# EAGLE design nintendo-hid (EAGLE 7.4.0)

## Sheet 1 of 5: MCU
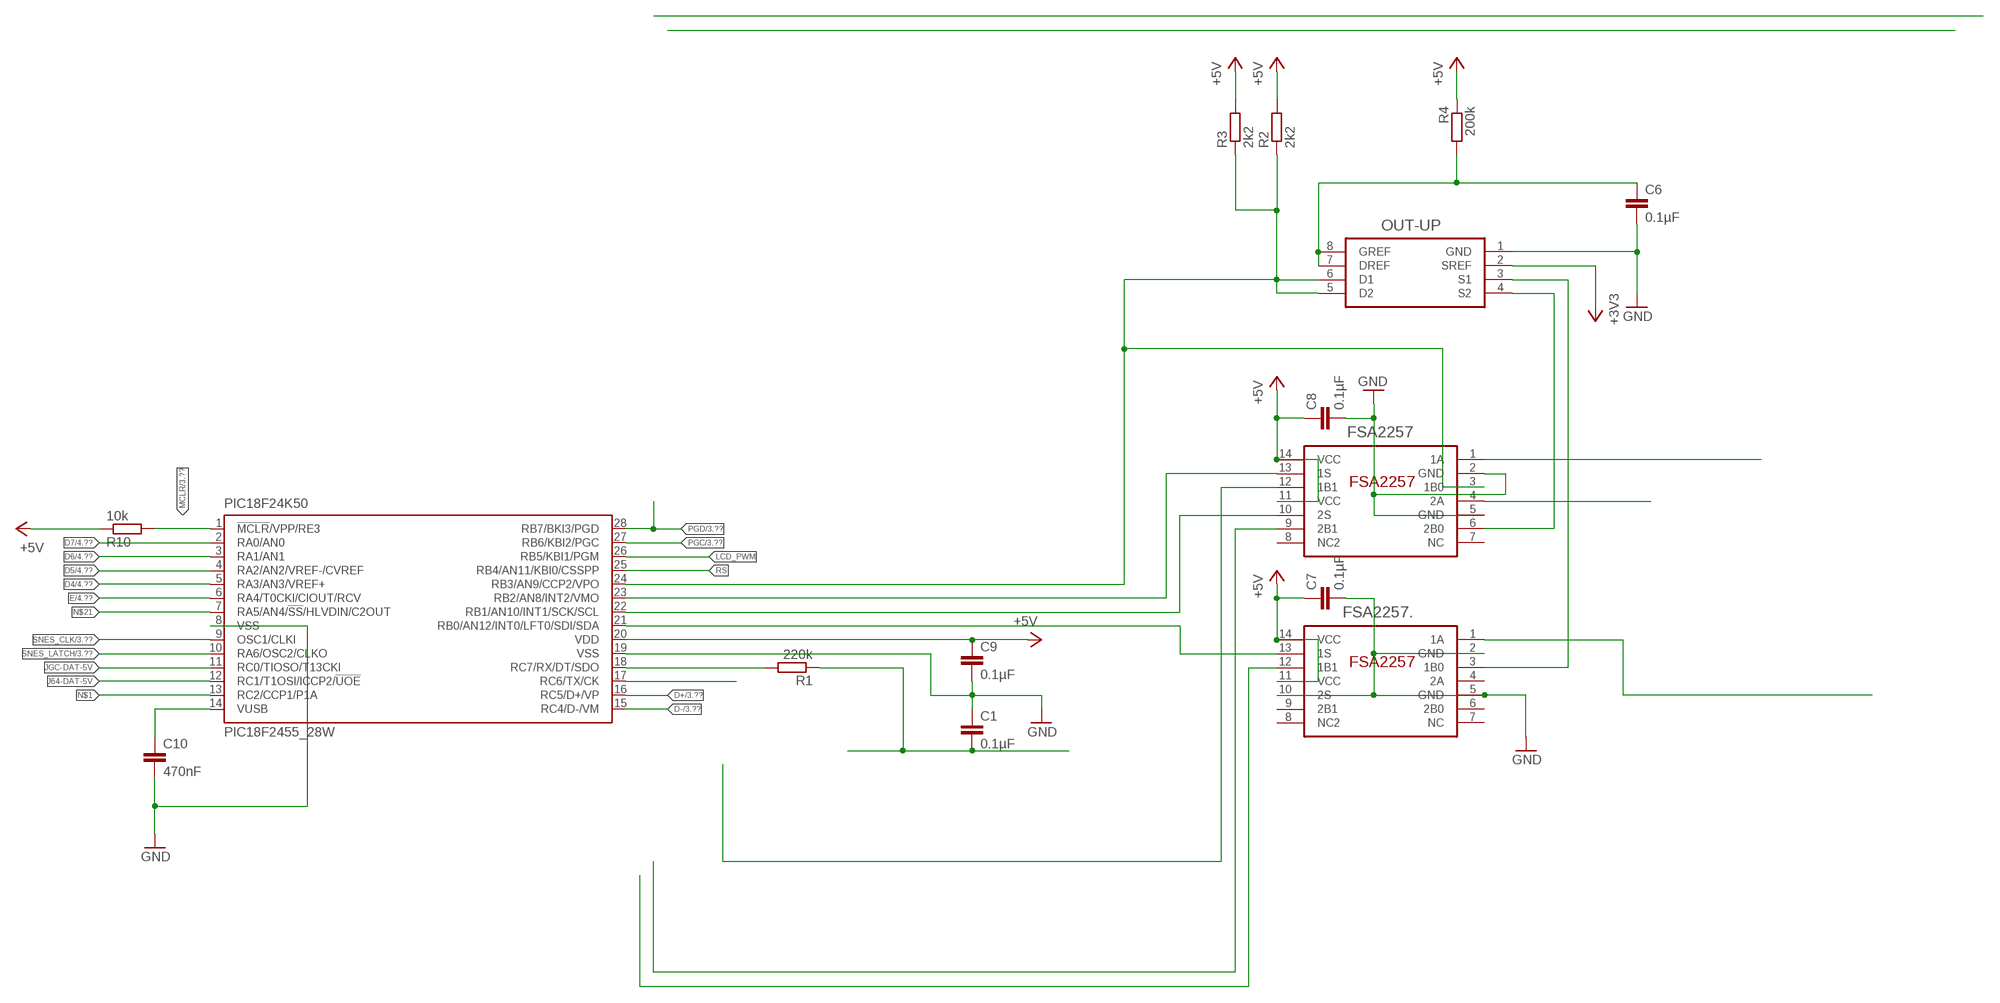
[diagram p0: schematic, sheet 1]

### Parts
C1  0.1µF  C-EUC0603  [C0603]
C6  0.1µF  C-EUC0603  [C0603]
C7  0.1µF  C-EUC0603  [C0603]
C8  0.1µF  C-EUC0603  [C0603]
C9  0.1µF  C-EUC0603K  [C0603K]
C10  470nF  C-EUC0603  [C0603]
FSA2257  FSA2257MTCX  [TSSOP14]
FSA2257.  FSA2257MTCX  [TSSOP14]
OUT-UP  GTL2002D  [SOIC127P600X175-8N]
PIC18F24K50  PIC18F2455_28W  [SO28W]
R1  220k  R-EU_R0603  [R0603]
R2  2k2  R-EU_R0603  [R0603]
R3  2k2  R-EU_R0603  [R0603]
R4  200k  R-EU_R0603  [R0603]
R10  10k  R-EU_R0603  [R0603]

### Nets
+3V3: OUT-UP.2(SREF) ; also sheet 3,5
+5V: C7.1 C8.1 C9.1 FSA2257.11(VCC) FSA2257.14(VCC) FSA2257..11(VCC) FSA2257..14(VCC) PIC18F24K50.20(VDD) R2.2 R3.2 R4.1 R10.1 ; also sheet 3,4,5
D4: PIC18F24K50.5(RA3/AN3/VREF+) ; also sheet 4
D5: PIC18F24K50.4(RA2/AN2/VREF-/CVREF) ; also sheet 4
D6: PIC18F24K50.3(RA1/AN1) ; also sheet 4
D7: PIC18F24K50.2(RA0/AN0) ; also sheet 4
D+: PIC18F24K50.16(RC5/D+/VP) ; also sheet 3
D-: PIC18F24K50.15(RC4/D-/VM) ; also sheet 3
E: PIC18F24K50.6(RA4/T0CKI/CIOUT/RCV) ; also sheet 4
FAKE_3V3.1: FSA2257.6(2B0) OUT-UP.4(S2)
FAKE_3V3.2: FSA2257..3(1B0) OUT-UP.3(S1)
FAKE_5V: FSA2257.3(1B0) OUT-UP.5(D2) OUT-UP.6(D1) PIC18F24K50.24(RB3/AN9/CCP2/VPO) R2.1 R3.1
GND: C1.1 C6.2 C7.2 C8.2 C9.2 C10.2 FSA2257.2(GND) FSA2257.5(GND) FSA2257..2(GND) FSA2257..5(GND) FSA2257..10(2S) OUT-UP.1(GND) PIC18F24K50.8(VSS) PIC18F24K50.19(VSS) ; also sheet 3,4,5
J64-DAT-5V: PIC18F24K50.12(RC1/T1OSI/ICCP2/!UOE)
J64_DAT: FSA2257.9(2B1) ; also sheet 3
JGC-DAT-5V: PIC18F24K50.11(RC0/TIOSO/T13CKI)
JGC_DAT: FSA2257..12(1B1) ; also sheet 3
JSNES_DAT: FSA2257.12(1B1)
LCD_PWM: PIC18F24K50.26(RB5/KBI1/PGM) ; also sheet 4
MCLR: PIC18F24K50.1(!MCLR!/VPP/RE3) R10.2 ; also sheet 3
N$1: PIC18F24K50.13(RC2/CCP1/P1A)
N$4: FSA2257.4(2A) ; also sheet 3
N$13: FSA2257..1(1A) ; also sheet 3
N$16: C10.1 PIC18F24K50.14(VUSB)
N$20: C6.1 OUT-UP.7(DREF) OUT-UP.8(GREF) R4.2
N$21: PIC18F24K50.7(RA5/AN4/!SS!/HLVDIN/C2OUT)
N$22: PIC18F24K50.17(RC6/TX/CK) ; also sheet 3
PGC: PIC18F24K50.27(RB6/KBI2/PGC) ; also sheet 3
PGD: PIC18F24K50.28(RB7/BKI3/PGD) ; also sheet 3
RS: PIC18F24K50.25(RB4/AN11/KBI0/CSSPP) ; also sheet 4
S1: FSA2257.13(1S) PIC18F24K50.23(RB2/AN8/INT2/VMO)
S2: FSA2257.10(2S) PIC18F24K50.22(RB1/AN10/INT1/SCK/SCL)
S3: FSA2257..13(1S) PIC18F24K50.21(RB0/AN12/INT0/LFT0/SDI/SDA)
SNES_CLK: PIC18F24K50.9(OSC1/CLKI) ; also sheet 3
SNES_LATCH: PIC18F24K50.10(RA6/OSC2/CLKO) ; also sheet 3
SNES_OUT: FSA2257.1(1A) ; also sheet 3
USB-SENSE: PIC18F24K50.18(RC7/RX/DT/SDO) R1.2
VBUS: C1.2 R1.1
Unconnected: FSA2257.7(NC) FSA2257.8(NC2) FSA2257..4(2A) FSA2257..6(2B0) FSA2257..7(NC) FSA2257..8(NC2) FSA2257..9(2B1)

## Sheet 2 of 5: SIGNALS

## Sheet 3 of 5: CONNECTORS
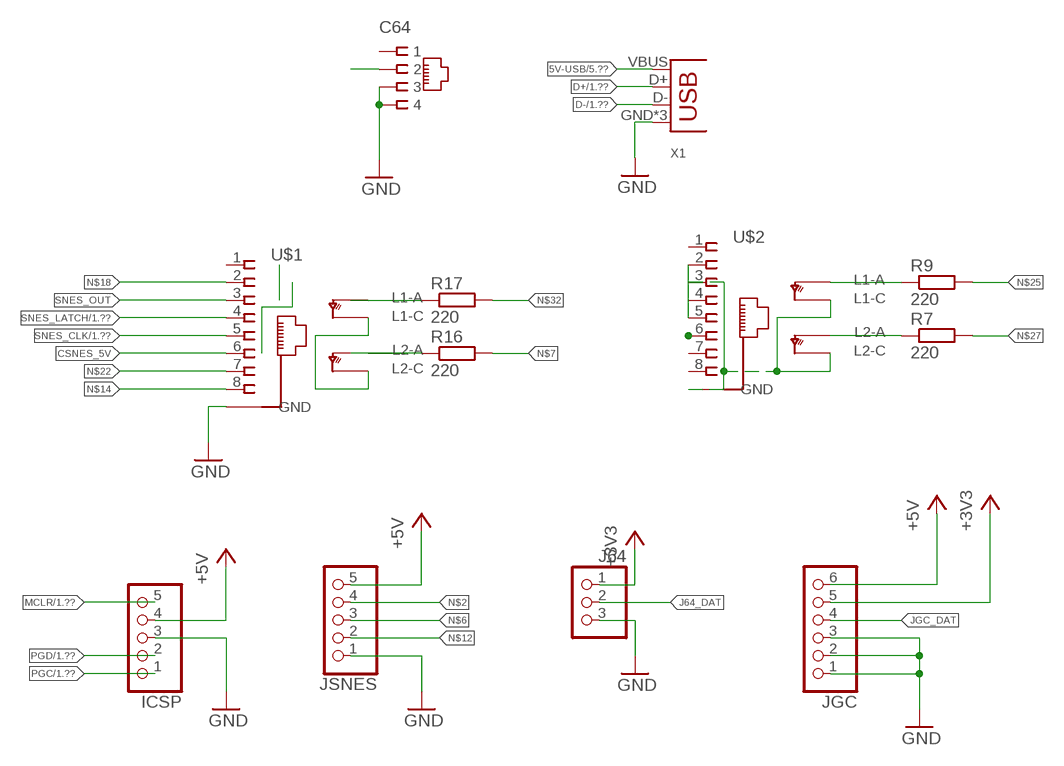
[diagram p1: schematic, sheet 3]

### Parts
C64  RJ11-6P4C  [RJ11-4C]
ICSP  PINHD-1X5  [1X05]
J64  PINHD-1X3  [1X03]
JGC  PINHD-1X6  [1X06]
JSNES  PINHD-1X5  [1X05]
R7  220  R-EU_R0603  [R0603]
R9  220  R-EU_R0603  [R0603]
R16  220  R-EU_R0603  [R0603]
R17  220  R-EU_R0603  [R0603]
U$1  RJ45-NIELS  [RJ45-NIELS]
U$2  RJ45-NIELS  [RJ45-NIELS]
X1  USB-B-NIELS  [USB-B-H]

### Nets
5V-USB: X1.VBUS ; also sheet 5
+3V3: J64.1 JGC.5 ; also sheet 1,5
+5V: ICSP.4 JGC.6 JSNES.5 ; also sheet 1,4,5
CSNES_5V: U$1.6
D+: X1.D+ ; also sheet 1
D-: X1.D- ; also sheet 1
GND: C64.3 C64.4 ICSP.3 J64.3 JGC.1 JGC.2 JGC.3 JSNES.1 U$1.GND@5(GND) U$1.GND@6(GND) U$1.LED-GREEN-C(L2C) U$1.LED-ORANGE-C(L1C) U$2.2 U$2.3 U$2.4 U$2.5 U$2.GND@5(GND) U$2.GND@6(GND) U$2.LED-GREEN-C(L2C) U$2.LED-ORANGE-C(L1C) X1.GND X1.GND@1(GND) X1.GND@2(GND) ; also sheet 1,4,5
J64_DAT: J64.2 ; also sheet 1
JGC_DAT: JGC.4 ; also sheet 1
MCLR: ICSP.5 ; also sheet 1
N$2: JSNES.4
N$4: C64.2 ; also sheet 1
N$6: JSNES.3
N$7: R16.2
N$8: R9.1 U$2.LED-ORANGE-A(L1A)
N$12: JSNES.2
N$13: U$2.6 ; also sheet 1
N$14: U$1.8
N$18: U$1.2
N$22: U$1.7 ; also sheet 1
N$23: R7.1 U$2.LED-GREEN-A(L2A)
N$25: R9.2
N$27: R7.2
N$28: U$1.LED-GREEN-A(L2A)
N$29: U$1.LED-ORANGE-A(L1A)
N$30: R17.1
N$31: R16.1
N$32: R17.2
PGC: ICSP.1 ; also sheet 1
PGD: ICSP.2 ; also sheet 1
SNES_CLK: U$1.5 ; also sheet 1
SNES_LATCH: U$1.4 ; also sheet 1
SNES_OUT: U$1.3 ; also sheet 1
Unconnected: C64.1 U$1.1 U$2.1 U$2.7 U$2.8

## Sheet 4 of 5: LCD
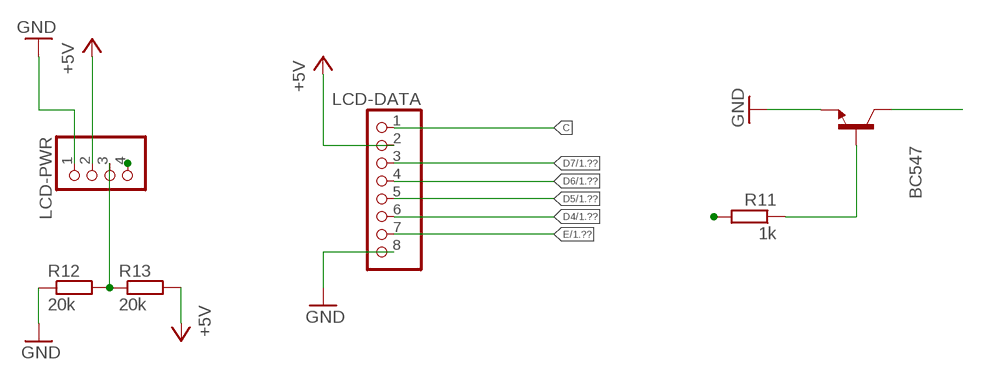
[diagram p2: schematic, sheet 4]

### Parts
BC547  BC547  [TO92]
LCD-DATA  PINHD-1X8  [1X08]
LCD-PWR  PINHD-1X4  [1X04]
R11  1k  R-EU_R0603  [R0603]
R12  20k  R-EU_R0603  [R0603]
R13  20k  R-EU_R0603  [R0603]

### Nets
+5V: LCD-DATA.2 LCD-PWR.2 R13.2 ; also sheet 1,3,5
C: BC547.3(C) LCD-DATA.1
D4: LCD-DATA.6 ; also sheet 1
D5: LCD-DATA.5 ; also sheet 1
D6: LCD-DATA.4 ; also sheet 1
D7: LCD-DATA.3 ; also sheet 1
E: LCD-DATA.7 ; also sheet 1
GND: BC547.1(E) LCD-DATA.8 LCD-PWR.1 R12.1 ; also sheet 1,3,5
LCD_PWM: R11.2 ; also sheet 1
N$19: BC547.2(B) R11.1
RS: LCD-PWR.4 ; also sheet 1
VEE: LCD-PWR.3 R12.2 R13.1

## Sheet 5 of 5: POWER
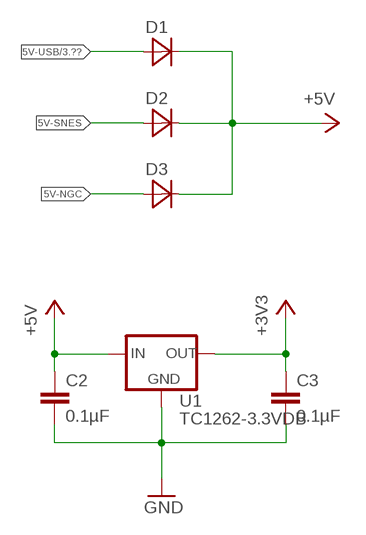
[diagram p3: schematic, sheet 5]

### Parts
C2  0.1µF  C-EUC0603  [C0603]
C3  0.1µF  C-EUC0603  [C0603]
D1  MBR120VLSFT1G  [SOD123]
D2  MBR120VLSFT1G  [SOD123]
D3  MBR120VLSFT1G  [SOD123]
U1  TC1262-3.3VDB  [SOT230P700X180-4N]

### Nets
5V-NGC: D3.2(A)
5V-SNES: D2.2(A)
5V-USB: D1.2(A) ; also sheet 3
+3V3: C3.1 U1.3(OUT) ; also sheet 1,3
+5V: C2.1 D1.1(C) D2.1(C) D3.1(C) U1.1(IN) ; also sheet 1,3,4
GND: C2.2 C3.2 U1.2(GND) U1.4(GND) ; also sheet 1,3,4

## Library data of the parts
BC547 = transistor-npn:BC547*: NPN Transistor
C1-C3 C6-C10 = resistor:C-EU: CAPACITOR, European symbol
C64 = frank:RJ11-6P4C
D1-D3 = frank:MBR120VLSFT1G: DIODE, SCHOTTKY, 1A, 20V, SOD-123FL
FSA2257 FSA2257. = frank:FSA2257MTCX
ICSP JSNES = pinhead:PINHD-1X5: PIN HEADER
J64 = pinhead:PINHD-1X3: PIN HEADER
JGC = pinhead:PINHD-1X6: PIN HEADER
LCD-DATA = pinhead:PINHD-1X8: PIN HEADER
LCD-PWR = pinhead:PINHD-1X4: PIN HEADER
OUT-UP = frank:GTL2002D: Bidirectional low voltage translator,SOIC-8; MPN: GTL2002D; OC_FARNELL: 2212066; OC_NEWARK: 55W4097; PACKAGE: SOIC-8; SUPPLIER: NXP
PIC18F24K50 = microchip:PIC18F2*_28: USB Microcontrollers with nanoWatt Technology High-Performance, Enhanced Flash, 28/40/44-Pin, Source: http://ww1.microchip.com/downloads/en/devicedoc/39632c.pdf; MF: MICROCHIP; MPN: PIC18F2455-I/SO; OC_FARNELL: 1579598; OC_NEWARK: 64J3768
R1-R4 R7 R9-R13 R16 R17 = resistor:R-EU_: RESISTOR, European symbol
U1 = frank:TC1262-3.3VDB: IC, 500mA Fixed Output CMOS LDO,3.3V,SOT-223, 3-lead; MPN: TC1262-3.3VDB; OC_FARNELL: 1852183; OC_NEWARK: 53R0370; PACKAGE: SOT-223-3; SUPPLIER: Microchip
U$1 U$2 = frank:RJ45-NIELS
X1 = frank:USB: USB Connectors

## Net classes
0 default: width 0.203 mm, drill 0.33 mm, clearance 0.203 mm

## Board
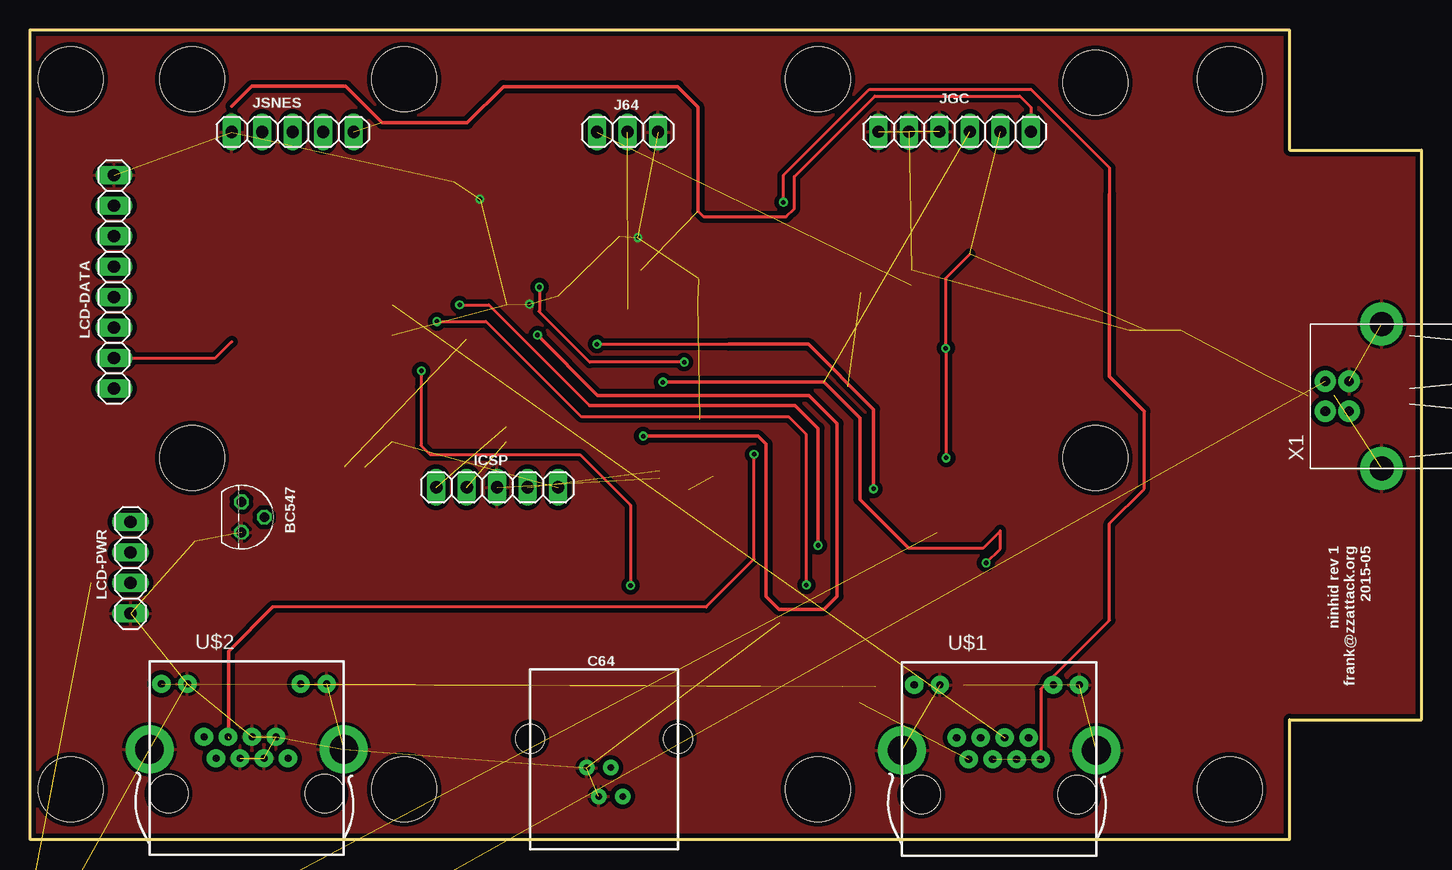
[diagram p4: board, top side]
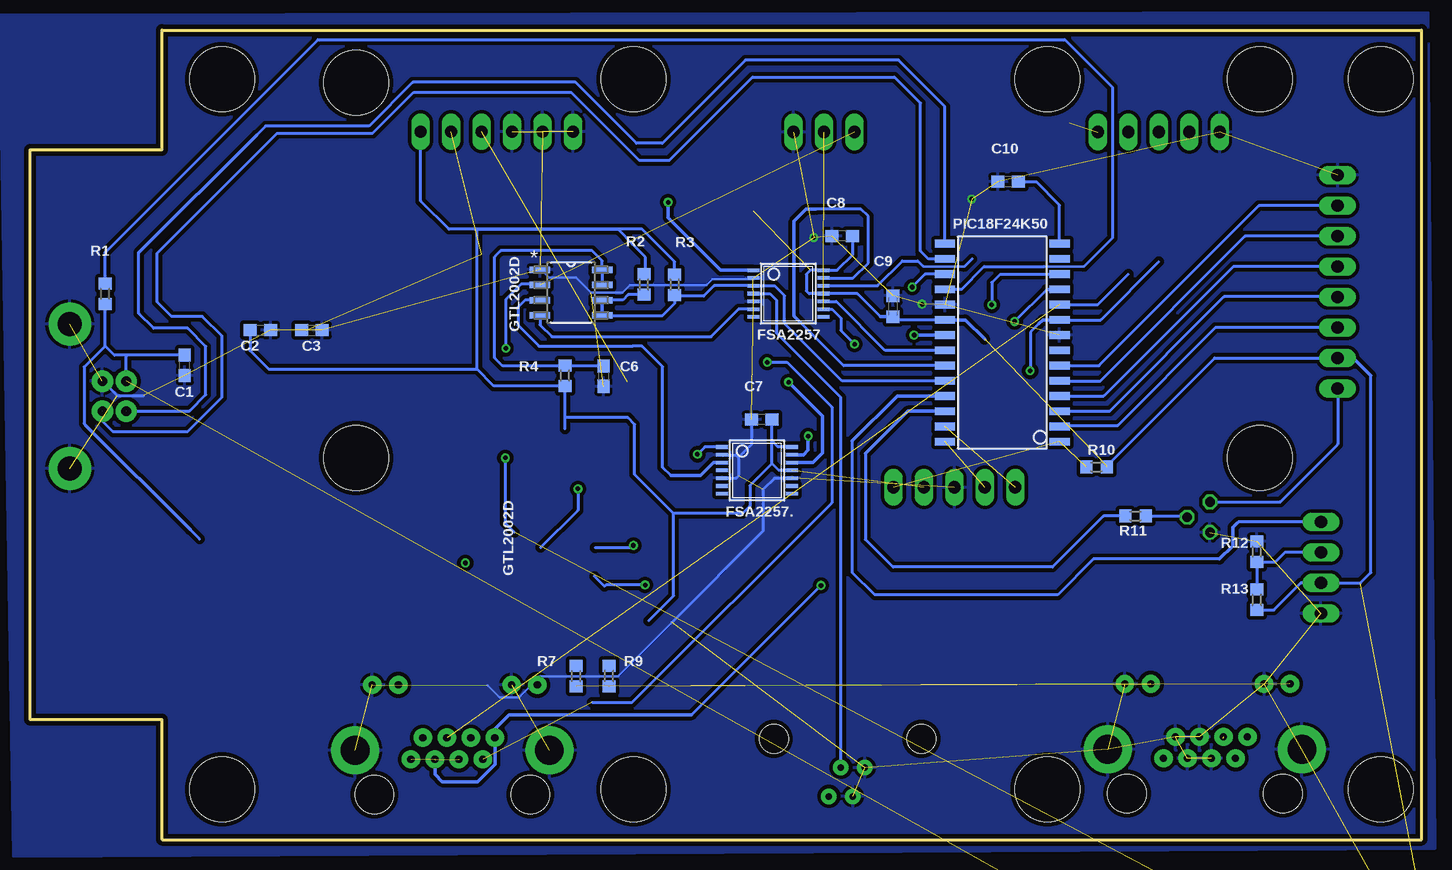
[diagram p5: board, bottom side, seen from below]

Size 116 x 67.5 mm. Coordinates in mm from the lower left corner, seen from the top.
Outline: 105,0 0,0 0,67.5 105,67.5 105,57.5 116,57.5 116,10 105,10 105,0
Copper layers (1*16): Top 0.0356mm / dielectric 1.5011mm / Bottom 0.0356mm
Design rules "LaenPCBOrder *": minimum track width 6mil, minimum drill 13mil, track to track 6mil, track to pad 6mil, pad to pad 6mil, via to via 6mil, smd to smd 6mil, copper to edge 15mil, drill to drill 6mil, minimum pad ring 7mil, minimum via ring 7mil, stop-mask expansion 3mil, vias tented up to drill 0mil, thermal gap 10mil
Holes 5.4 mm at 3.4,63.4 3.4,4.17 31.2,63.4 65.7,63.4 100,63.4 31.2,4.17 65.7,4.17 100,4.17 13.5,31.8 88.8,31.8 13.5,63.4 88.8,63.1

### Footprints (pad centres in the part's own frame; a part is rotated, then mirrored left to right if it is on the bottom)
TO92 = drill 0.813 octagon: 1 1.27,0; 2 0,1.905; 3 -1.27,0
C0603 = smd 1.1 x 1: 1 -0.85,0; 2 0.85,0
C0603K = smd 1.05 x 1.08: 1 -0.875,0; 2 0.875,0
RJ11-4C = drill 0.55 pad 1.3: 1 4.6,10.6; 2 5.6,8.2; 3 6.6,10.6; 4 7.6,8.2 | hole 2.4: 0,5.8; 12.3,5.8
SOD123 = smd 1.6 x 0.8: 1 -1.7,0; 2 1.7,0
TSSOP14 = smd 0.305 x 0.991: 1 -1.95,-2.918; 2 -1.3,-2.918; 3 -0.65,-2.918; 4 0,-2.918; 5 0.65,-2.918; 6 1.3,-2.918; 7 1.95,-2.918; 8 1.95,2.918; 9 1.3,2.918; 10 0.65,2.918; 11 0,2.918; 12 -0.65,2.918; 13 -1.3,2.918; 14 -1.95,2.918
1X05 = drill 1.016 long: 1 -5.08,0; 2 -2.54,0; 3 0,0; 4 2.54,0; 5 5.08,0
1X03 = drill 1.016 long: 1 -2.54,0; 2 0,0; 3 2.54,0
1X06 = drill 1.016 long: 1 -6.35,0; 2 -3.81,0; 3 -1.27,0; 4 1.27,0; 5 3.81,0; 6 6.35,0
1X08 = drill 1.016 long: 1 -8.89,0; 2 -6.35,0; 3 -3.81,0; 4 -1.27,0; 5 1.27,0; 6 3.81,0; 7 6.35,0; 8 8.89,0
1X04 = drill 1.016 long: 1 -3.81,0; 2 -1.27,0; 3 1.27,0; 4 3.81,0
SOIC127P600X175-8N = smd 1.702 x 0.533: 1 -2.591,1.905; 2 -2.591,0.635; 3 -2.591,-0.635; 4 -2.591,-1.905; 5 2.591,-1.905; 6 2.591,-0.635; 7 2.591,0.635; 8 2.591,1.905
SO28W = smd 0.65 x 1.7: 1 -7.62,-4.78; 2 -6.35,-4.78; 3 -5.08,-4.78; 4 -3.81,-4.78; 5 -2.54,-4.78; 6 -1.27,-4.78; 7 0,-4.78; 8 1.27,-4.78; 9 2.54,-4.78; 10 3.81,-4.78; 11 5.08,-4.78; 12 6.35,-4.78; 13 7.62,-4.78; 14 8.89,-4.78; 15 8.89,4.78; 16 7.62,4.78; 17 6.35,4.78; 18 5.08,4.78; 19 3.81,4.78; 20 2.54,4.78; 21 1.27,4.78; 22 0,4.78; 23 -1.27,4.78; 24 -2.54,4.78; 25 -3.81,4.78; 26 -5.08,4.78; 27 -6.35,4.78; 28 -7.62,4.78
R0603 = smd 1 x 1.1: 1 -0.85,0; 2 0.85,0
SOT230P700X180-4N = smd 1.626 x 0.889: 1 -3.2,2.311; 2 -3.2,0; 3 -3.2,-2.311 | smd 1.626 x 3.175: 4 3.2,0
RJ45-NIELS = drill 0.6 pad 1.524: 1 11.55,8.05; 2 10.55,9.85; 3 9.55,8.05; 4 8.55,9.85; 5 7.55,8.05; 6 6.55,9.85; 7 5.55,8.05; 8 4.55,9.85; LED-GREEN-A 12.6,14.26; LED-GREEN-C 14.77,14.26; LED-ORANGE-A 1,14.26; LED-ORANGE-C 3.16,14.26 | drill 2.4 pad 4: GND@5 0,8.8; GND@6 16.2,8.8 | hole 3.2: 1.6,5.1; 14.6,5.1
USB-B-H = drill 0.8 pad 1.778: D+ 0,1.25; D- 1.981,1.25; GND 0,-1.25; VBUS 1.981,-1.25 | drill 2 pad 3.556: GND@1 -2.718,-6.02; GND@2 -2.718,6.02

### Placement (x,y rotation side)
BC547  17.63,26.88 270 top
C1  103.1,39.54 90 bottom
C2  96.8,42.48 0 bottom
C3  92.5,42.46 0 bottom
C6  68.2,38.64 270 bottom
C7  55,35.02 180 bottom
C8  48.3,50.32 180 bottom
C9  44.06,44.46 90 bottom
C10  34.46,54.84 180 bottom
C64  54,14.2 180 top
D1  1.54,-20.58 0 top  (outside the outline)
D2  1.54,-13.28 0 top  (outside the outline)
D3  1.54,-5.98 0 top  (outside the outline)
FSA2257  52.78,45.52 270 bottom
FSA2257.  55.4,30.78 270 bottom
ICSP  38.95,29.37 0 top
J64  49.82,59 0 top
JGC  77.08,59.02 0 top
JSNES  21.9,59 0 top
LCD-DATA  7,46.5 90 top
LCD-PWR  8.38,22.66 90 top
OUT-UP  70.9,45.6 0 bottom
PIC18F24K50  34.95,40.79 90 bottom
R1  109.74,45.5 90 bottom
R2  64.82,46.28 90 bottom
R3  62.26,46.26 90 bottom
R4  71.4,38.68 90 bottom
R7  70.48,13.62 90 bottom
R9  67.74,13.64 90 bottom
R10  27.1,31.06 180 bottom
R11  23.84,26.97 180 bottom
R12  13.74,24 270 bottom
R13  13.74,19.99 270 bottom
R16  -12.2,-26.6 0 top  (outside the outline)
R17  -12.2,-31.36 0 top  (outside the outline)
U1  -7.3,-17.7 0 top  (outside the outline)
U$1  72.7,-1.36 0 top
U$2  9.96,-1.28 0 top
X1  109.96,36.96 180 top

### Tracks (layer width: path | path; a pad name or v marks a point on that pad's centre or on a via)
5V-USB  (1 unrouted)
+3V3  (via drill 0.38)  (4 unrouted)
  Top 0.254: v76.38,31.82 76.4,40.9 v76.34,40.96 76.34,46.8 78.35,48.81
  Bottom 0.254: OUT-UP.2 73.56,46.3 75.06,46.3 76.34,45.02 v76.34,40.96 | v76.38,31.82 76.38,26.38 75.61,25.61
  Bottom 0.406: C3.1 92.99,42.46
+5V  (9 unrouted)
  Top 0.254: 55.68,52.4 56.16,51.92 63.04,51.92 63.72,52.6 63.72,55.28 70.42,61.98 82.52,61.98 83.43,61.07 JGC.6 | LCD-DATA.2 15.45,40.15 16.82,41.52
  Top 0.305: 55.68,52.4 55.68,61.08 53.98,62.78 39.46,62.78 36.44,59.76 29.36,59.76 26.32,62.8 18.48,62.8 16.82,61.14
  Bottom 0.254: 4.22,38.68 4.22,22.26 5.09,21.39 LCD-PWR.2 10.05,21.39 12.3,19.14 R13.2 | R2.2 64.69,47.26 64.69,48.55 65.78,49.64 65.78,49.66 67,50.88 64.96,50.88 62.26,48.18 R3.2 | PIC18F24K50.20 43.8,43.33 C9.1 | 78.74,39.22 78.74,50.88 81.08,50.88 83.43,53.23 JGC.6 | 78.74,39.22 77.35,37.83 R4.1 71.4,35.18 | 64.42,18.24 62.34,20.32 62.34,27.18 | C2.1 97.65,40.77 96.1,39.22 78.74,39.22 | C8.1 47.45,48.73 48.71,47.47 FSA2257.14 50.95,47.47 51.28,47.14 51.28,45.74 51.06,45.52 FSA2257.11 47.04,45.52 45.1,43.59 | FSA2257..14 53.65,32.73 54.15,33.23 | 54.15,33.23 C7.1 | FSA2257..11 53.58,30.78 54.15,31.35 | 54.15,31.35 54.15,33.23 | 54.15,31.35 55.98,29.52 55.98,27.82 56.62,27.18 62.34,27.18 | 71.4,34.23 71.4,35.18 | 62.34,27.18 65.6,30.44 65.6,34.62 66.16,35.18 71.4,35.18 | 26.25,31.15 17.25,40.15 LCD-DATA.2
  Bottom 0.305: 78.74,50.88 67,50.88 | PIC18F24K50.20 38.03,43.33 36.41,41.71 | C9.1 45.1,43.59 | LCD-DATA.2 5.69,40.15 4.22,38.68
  Bottom 0.406: 97.61,42.48 C2.1 97.61,42.52
C
  Bottom 0.254: BC547.3 11.79,28.15 7,32.94 LCD-DATA.1
D4
  Bottom 0.254: LCD-DATA.6 14.71,50.31 26.77,38.25 PIC18F24K50.5
D5
  Bottom 0.254: PIC18F24K50.4 26.48,36.98 15.69,47.77 LCD-DATA.5
D6
  Bottom 0.254: LCD-DATA.4 7.41,45.23 7.44,45.26 16.46,45.26 26,35.72 PIC18F24K50.3
D7
  Bottom 0.254: LCD-DATA.3 17.17,42.69 25.32,34.54 30.07,34.54 PIC18F24K50.2
D+  (1 unrouted)
  Bottom 0.254: PIC18F24K50.16 41.09,48.41 41.76,49.08 41.76,61.4 43.94,63.58 55.76,63.58 62.72,56.62 65.2,56.62 70.89,62.31 84.01,62.31 87.44,58.88 95.4,58.88 105.38,48.9 105.38,44.8 104.2,43.62 101.64,43.62 100.04,42.02 100.04,36.84 102.88,34 109.08,34 109.96,34.88 109.96,35.75
D-  (1 unrouted)
  Bottom 0.254: PIC18F24K50.15 39.73,61.11 43.6,64.98 56.36,64.98 63.28,58.06 65.44,58.06 70.52,63.14 84.1,63.14 87.74,59.5 96.36,59.5 97.12,58.74 | 107.98,35.75 102.69,35.75 101.34,37.1 101.34,41.12 102.86,42.64 105.7,42.64 106.92,43.86 106.92,48.94
  Bottom 0.305: 97.12,58.74 106.92,48.94
E
  Bottom 0.254: PIC18F24K50.6 26.88,39.52 13.55,52.85 LCD-DATA.7
FAKE_3V3.1
  Bottom 0.254: OUT-UP.4 73.49,42.91 72.5,41.92 59.22,41.92 56.92,44.22 FSA2257.6
FAKE_3V3.2
  Bottom 0.254: OUT-UP.3 74.73,44.97 75.32,44.38 75.32,42.88 73.58,41.14 65.76,41.14 64.98,41.14 63.26,39.42 63.26,31.04 62.58,30.36
  Bottom 0.305: FSA2257..3 59.04,31.44 60.12,30.36 62.58,30.36
FAKE_5V
  Bottom 0.254: R2.1 66.13,45.43 66.58,44.98 68.29,44.98 OUT-UP.6 | OUT-UP.5 63.27,43.7 62.26,44.7 R3.1 62.15,45.3 59.84,45.3 58.97,46.17 FSA2257.3 53.93,46.17 53.1,45.34 53.1,43.04 48.31,38.25 PIC18F24K50.24
  Bottom 0.305: OUT-UP.5 OUT-UP.6
GND  (via drill 0.38)  (45 unrouted)
  Bottom 0.203: 62.5,18.12 67,13.62 73.5,13.62 75.25,11.88 76.88,11.88 77.86,12.86 | 52.5,30.12 FSA2257..10 | OUT-UP.1 73.38,47.5 72.75,46.88 70.5,46.88 69.25,45.62 66.62,45.62 66,46.25 59.62,46.25 59.12,46.75 55.75,46.75 FSA2257.2
  Bottom 0.254: FSA2257..2 57.16,32.08 56.94,31.86 | FSA2257..5 57.11,30.13 56.94,30.3 56.94,31.86 | C7.2 55.85,32.95 56.94,31.86 | 52.5,30.12 53.95,30.12 54.9,29.18 54.9,25.73 62.5,18.12 | 109.96,38.25 108.73,37.02 106.54,37.02
  other vias: 41.64,44.64 50.66,50.2 37.5,53.4
  pour Bottom (isolate 0.305): -1.16,-0.71 -0.56,68.94 118.6,68.74 117.4,-1.39
  pour Top (isolate 0.381): -1.04,-0.72 -1.34,69.24 118.34,68.72 116.68,-1.46
J64-DAT-5V  (via drill 0.38)
  Top 0.254: v35.82,44.58 38.26,44.58 46.64,36.2
  Top 0.305: v65.7,24.52 65.7,34.28 63.78,36.2 46.64,36.2
  Bottom 0.254: 68.88,24.32 68.89,24.34 65.89,24.34 | PIC18F24K50.12 35.12,47.14 35.82,46.44 v35.82,44.58
  Bottom 0.305: 65.89,24.34 v65.7,24.52
J64_DAT  (via drill 0.38)  (1 unrouted)
  Top 0.254: 58.26,41.3 v47.26,41.3 47.28,41.32
  Top 0.305: v70.32,29.24 70.32,35.86 64.88,41.3 58.26,41.3
  Bottom 0.254: FSA2257.9 49.14,44.22 48.4,43.48 48.4,42.44 v47.26,41.3 | 73.42,24.34 70.32,27.44 v70.32,29.24
JGC-DAT-5V  (via drill 0.38)
  Top 0.254: v64.72,21.22 64.72,33.78 63.26,35.24 45.98,35.24 38.02,43.2 v33.92,43.2
  Bottom 0.254: 68.95,21.95 68.11,21.11 68,21.22 v64.72,21.22 | 31.25,45.87 v33.92,43.2
  Bottom 0.305: PIC18F24K50.11 31.25,45.87
JGC_DAT  (via drill 0.38)  (1 unrouted)
  Top 0.254: 73.22,24.32 79.48,24.32 80.89,25.73 80.89,24.25 v79.7,23.07
  Top 0.305: v52.76,38.14 66.18,38.14 69.18,35.14 69.18,28.36 73.22,24.32
  Bottom 0.305: FSA2257..12 50.75,31.43 49.94,32.24 49.94,35.32 v52.76,38.14
JSNES_DAT
  Bottom 0.203: 38.1,47.78 41.52,47.78
  Bottom 0.254: FSA2257.12 45.35,46.17 43.28,48.24 41.98,48.24 41.52,47.78 | 38.1,47.78 37.47,48.41
LCD_PWM
  Bottom 0.254: 46.36,32.18 46.36,25.02 44.06,22.72 30.76,22.72 26.51,26.97 R11.2
  Bottom 0.305: PIC18F24K50.26 42.83,35.71 46.36,32.18
MCLR  (2 unrouted)
N$4
  Bottom 0.254: C64.2 48.4,36.86 53.78,42.24 53.78,44.98 54.32,45.52 FSA2257.4
N$8  (1 unrouted)
N$13  (via drill 0.38)  (1 unrouted)
  Top 0.254: 20.24,19.38 56.36,19.38 60.36,23.38 v60.36,32.12
  Top 0.305: 16.55,8.45 16.55,15.69 20.24,19.38
  Bottom 0.254: FSA2257..1 59.75,32.73 v60.36,32.12
N$16
  Bottom 0.254: PIC18F24K50.14 30.17,52.89 32.12,54.84 C10.1
N$19
  Bottom 0.254: R11.1 19.62,26.97 BC547.2
N$20
  Bottom 0.254: OUT-UP.7 OUT-UP.8 68.31,48.27 69.14,49.1 76.76,49.1 77.26,48.6 77.26,40.16 76.59,39.49 71.44,39.49 R4.2 71.36,39.49 C6.1
N$22  (via drill 0.38)  (1 unrouted)
  Top 0.254: v54.54,39.8 46.66,39.8 42.43,44.03 42.46,44.06 v42.46,46.06
  Bottom 0.254: 69.13,11.42 65.82,11.42 49.16,28.08 49.16,36.06 52.9,39.8 v54.54,39.8 | PIC18F24K50.17 41.38,47.14 v42.46,46.06
N$23  (1 unrouted)
PGC  (1 unrouted)
PGD  (1 unrouted)
RS
  Bottom 0.254: 47.46,33.22 47.46,22.28 45.58,20.4 30.32,20.4 27.34,23.38 16.84,23.38 | LCD-PWR.4 15.29,26.47 15.35,26.41
  Bottom 0.305: PIC18F24K50.25 43.7,36.98 47.46,33.22 | 15.35,26.41 15.72,26.04 15.72,24.5 16.84,23.38
S1
  Bottom 0.254: FSA2257.13 47.38,46.82 46.12,48.08 46.12,51.96 46.72,52.56 50.46,52.56 | PIC18F24K50.23 48.18,39.52 51.78,43.12
  Bottom 0.305: 51.78,43.12 52.3,43.64 52.3,51.56 51.3,52.56 50.46,52.56
S2
  Bottom 0.254: PIC18F24K50.22 44.71,40.79 48.79,44.87 FSA2257.10
S3  (via drill 0.38)
  Top 0.305: v51.12,33.64 60.68,33.64 61.36,32.96 61.36,20.28 62.44,19.2 66.2,19.2 67.28,20.28 67.28,34.68 64.92,37.04 47.32,37.04 v42.3,42.06
  Bottom 0.305: FSA2257..13 51.54,32.08 51.14,32.48 51.14,33.62 v51.12,33.64 | v42.3,42.06 PIC18F24K50.21
SNES_CLK  (via drill 0.38)  (1 unrouted)
  Top 0.254: v32.62,39.08 32.6,37.74 32.6,32.86 33.36,32.1 45.84,32.1 50.06,27.88 v50.06,21.18
  Bottom 0.254: PIC18F24K50.9 26.75,43.33 21.9,48.18 | 60.84,10.4 v50.06,21.18 | 31.88,43.02 32.6,42.3 v32.62,39.08
  Bottom 0.305: PIC18F24K50.9 31.57,43.33 31.88,43.02 | 82.25,6.65 82.25,5.43 81.64,4.82 78.68,4.82 77.24,6.26 77.24,9.24 76.08,10.4 60.84,10.4
SNES_LATCH  (1 unrouted)
  Bottom 0.254: PIC18F24K50.10 26.98,44.6 24.44,47.14
SNES_OUT  (via drill 0.38)  (1 unrouted)
  Top 0.254: 92.88,35.7 92.88,29.24 89.98,26.34 89.98,18.28 84.25,12.55 84.25,6.65 | v62.8,53.14 62.8,55.38 69.98,62.56 83.44,62.56 89.98,56.02 89.98,53.82
  Top 0.305: 92.88,35.7 89.98,38.6 89.98,53.82
  Bottom 0.305: FSA2257.1 58.43,47.47 62.8,51.84 v62.8,53.14
USB-SENSE
  Bottom 0.203: 28.14,47.78 31.44,47.78
  Bottom 0.254: R1.2 109.74,48.94 91.98,66.7 29.74,66.7 25.76,62.72 25.76,50.16 28.14,47.78 | PIC18F24K50.18 38.37,45.87 36.46,47.78 31.44,47.78
VBUS
  Bottom 0.254: 109.74,41.16 111.5,39.4 111.5,34.7 111.3,34.5 | 101.86,25.06 102.65,25.85 | 109.74,41.16 R1.1 | C1.2 107.86,40.39 | 107.86,40.39 108.97,40.39 109.74,41.16 | 107.98,38.25 107.98,40.27 107.86,40.39
  Bottom 0.305: 102.65,25.85 111.3,34.5
VEE
  Bottom 0.254: R13.1 R12.2 12.19,23.15 11.41,23.93 LCD-PWR.3

### Text on the board
tNames: ninhid rev 1 / frank@zzattack.org / 2015-05
bNames: GTL2002D | GTL2002D
_bplace: * | * | * | * | *